# Altium schematic sheet Power.SchDoc
size A4; SheetNumber: 5; SheetTotal: 6
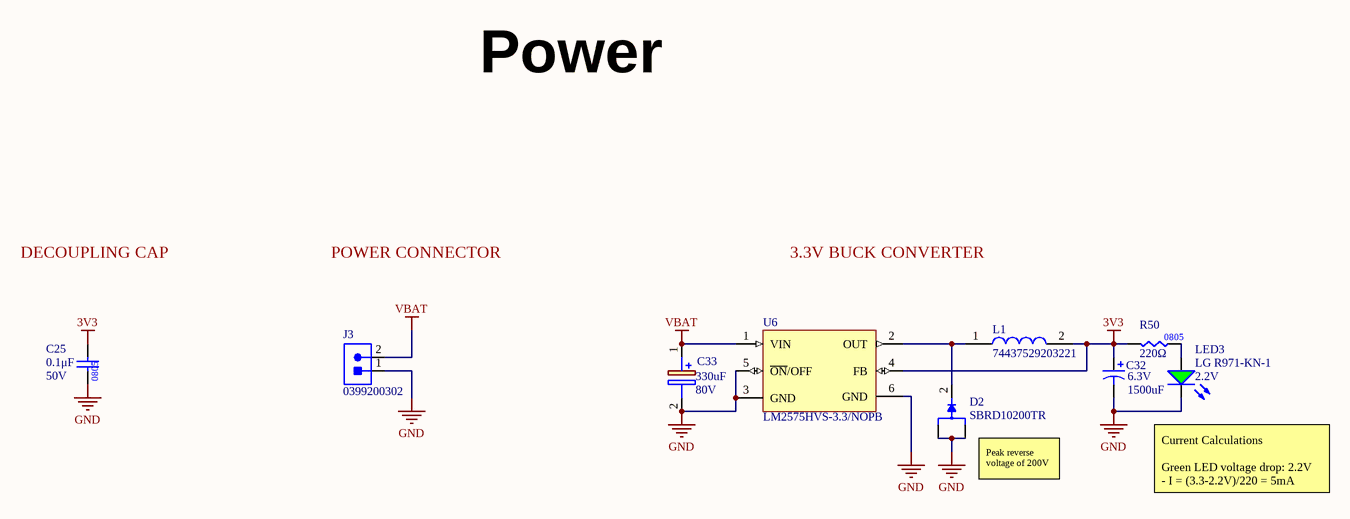
[diagram p0: Power.SchDoc]

## Parts
C25  value 0.1μF  Voltage Rating: 50V  [CAP2012]  (hidden comment: CAP_0.1uF_50V_0805)
C32  Voltage: 6.3V  Capacitance: 1500uF  [CAPAE1030X1080N]  (hidden comment: PCJ0J152MCL1GS)
C33  Capacitance: 330uF  Voltage: 80V  [EEEFK0J682AM]  (hidden comment: EEV-FK1K331M)
D2  SBRD10200TR  [DPAK228P1005X240-4N]
J3  Manufacturer Part Number 1: 0399200302  [MOLEX-0399200302]  (hidden comment: CONN_SCREW_TERM_115A)
L1  74437529203221  [74437529203221]
LED3  Forward Voltage Drop: 2.2V  Manufacturer Part Number 1: LG R971-KN-1  [LED_0805_GREEN]  (hidden comment: LED_GREEN)
R50  value 220Ω  [RES0805]  (hidden comment: RES_220Ω_0805_5%)
U6  LM2575HVS-3.3/NOPB  [VREG_TPS79625KTTR]

## Nets
3V3: C25.2 C32.1 L1.2 R50.1 U6.4(FB)
GND: C25.1 C32.2 C33.2(-) D2.1 D2.3 J3.1 LED3.2(K) U6.3(GND) U6.5(~{ON}/OFF) U6.6(GND)
VBAT: C33.1(+) J3.2 U6.1(VIN)
NetD2_2: D2.2 L1.1 U6.2(OUT)
NetLED3_1: LED3.1(A) R50.2

## Notes on the sheet
- Power
- DECOUPLING CAP
- POWER CONNECTOR
- 3.3V BUCK CONVERTER
- (near D2) Peak reverse voltage of 200V
- Current Calculations
  Green LED voltage drop: 2.2V
  - I = (3.3-2.2V)/220 = 5mA

## Library data of the parts
C25 = CAP_0.1uF_50V_0805: CAP CER 0.1UF 50V X7R 0805; Manufacturer Part Number 1: GCM21BR71H104KA37K; Manufacturer 1: Murata Electronics; Package/Footprint: 0805; Supplier Part Number 1: 490-8049-1-ND; Supplier 1: Digi-Key; Dielectric: X7R; LCSC Part #: C49678; Mounting Type: SMD
C33 = EEV-FK1K331M: Capacitor Polarised; Manufacturer_Name: Panasonic; Datasheet Link: http://industrial.panasonic.com/cdbs/www-data/pdf/RDE0000/ABA0000C1181.pdf; Height: 17mm; Mouser Part Number: 667-EEV-FK1K331M; Mouser Price/Stock: https://www.mouser.co.uk/ProductDetail/Panasonic/EEV-FK1K331M?qs=f%252BPvLx1Hi0niAwhZUCTEVQ%3D%3D; Manufacturer Part Number 1: EEV-FK1K331M
D2 = SBRD10200TR: SBRD10200 Series 200 V 10 A Surface Mount Schottky Rectifier - TO-252-3; Availability: Unavailable; Package: None; Value: *; Price: None; Manufacturer Part Number 1: SBRD10200TR
J3 = CONN_SCREW_TERM_115A: CONN TERM BLOCK 2POS 15MM 1-8AWG; Manufacturer 1: Molex; Pitch: 0.591inch; Wire Gauge (Max): 8AWG; Wire Gauge (Min): 1AWG; Supplier 1: Digi-Key; Supplier Part Number 1: WM20114-ND
L1 = 74437529203221: Inductor; Manufacturer_Name: Wurth Elektronik; Datasheet Link: https://www.mouser.com/datasheet/2/445/74437529203221-1280418.pdf; Height: 20.5mm; Mouser Part Number: 710-74437529203221; Mouser Price/Stock: https://www.mouser.co.uk/ProductDetail/Wurth-Elektronik/74437529203221?qs=f9yNj16SXrLAROUwbKRDKA%3D%3D; Manufacturer Part Number 1: 74437529203221
LED3 = LED_GREEN: LED GREEN DIFFUSED 0805 SMD; Manufacturer 1: OSRAM; Package/Footprint: 0805; Supplier Part Number 1: 475-1410-1-ND; Supplier 1: Digi-Key; Mounting Type: SMD
R50 = RES_220Ω_0805_5%: RES 220 OHM 5% 1/2W 0805; Manufacturer 1: Panasonic Electronic Components; Manufacturer Part Number 1: ERJ-P06J221V; Supplier Part Number 1: P220ADCT-ND; Supplier 1: Digi-Key; Mounting Type: SMD; LCSC Part #: C17557; Package: 0805
C32 = PCJ0J152MCL1GS: Supplier 1: Mouser; Supplier Part Number 1: 647-PCJ0J152MCL1GS; Manufacturer Part Number 1: PCJ0J152MCL1GS
U6 = LM2575HVS-3.3/NOPB: Package: None; Price: None; Value: *; MP: LM2575HVS-3.3/NOPB; Availability: Unavailable; Manufacturer Part Number 1: LM2575HVS-3.3/NOPB